# Altium schematic sheet Power.SchDoc: Power and Connectors
size A3; Organization: Hash define Electronics Ltd; Address1: 68 Concord Street; Address2: Leeds, WY; Address3: LS2 7QS; Address4: United Kindom; Revision: 0; SheetNumber: 2; SheetTotal: 2
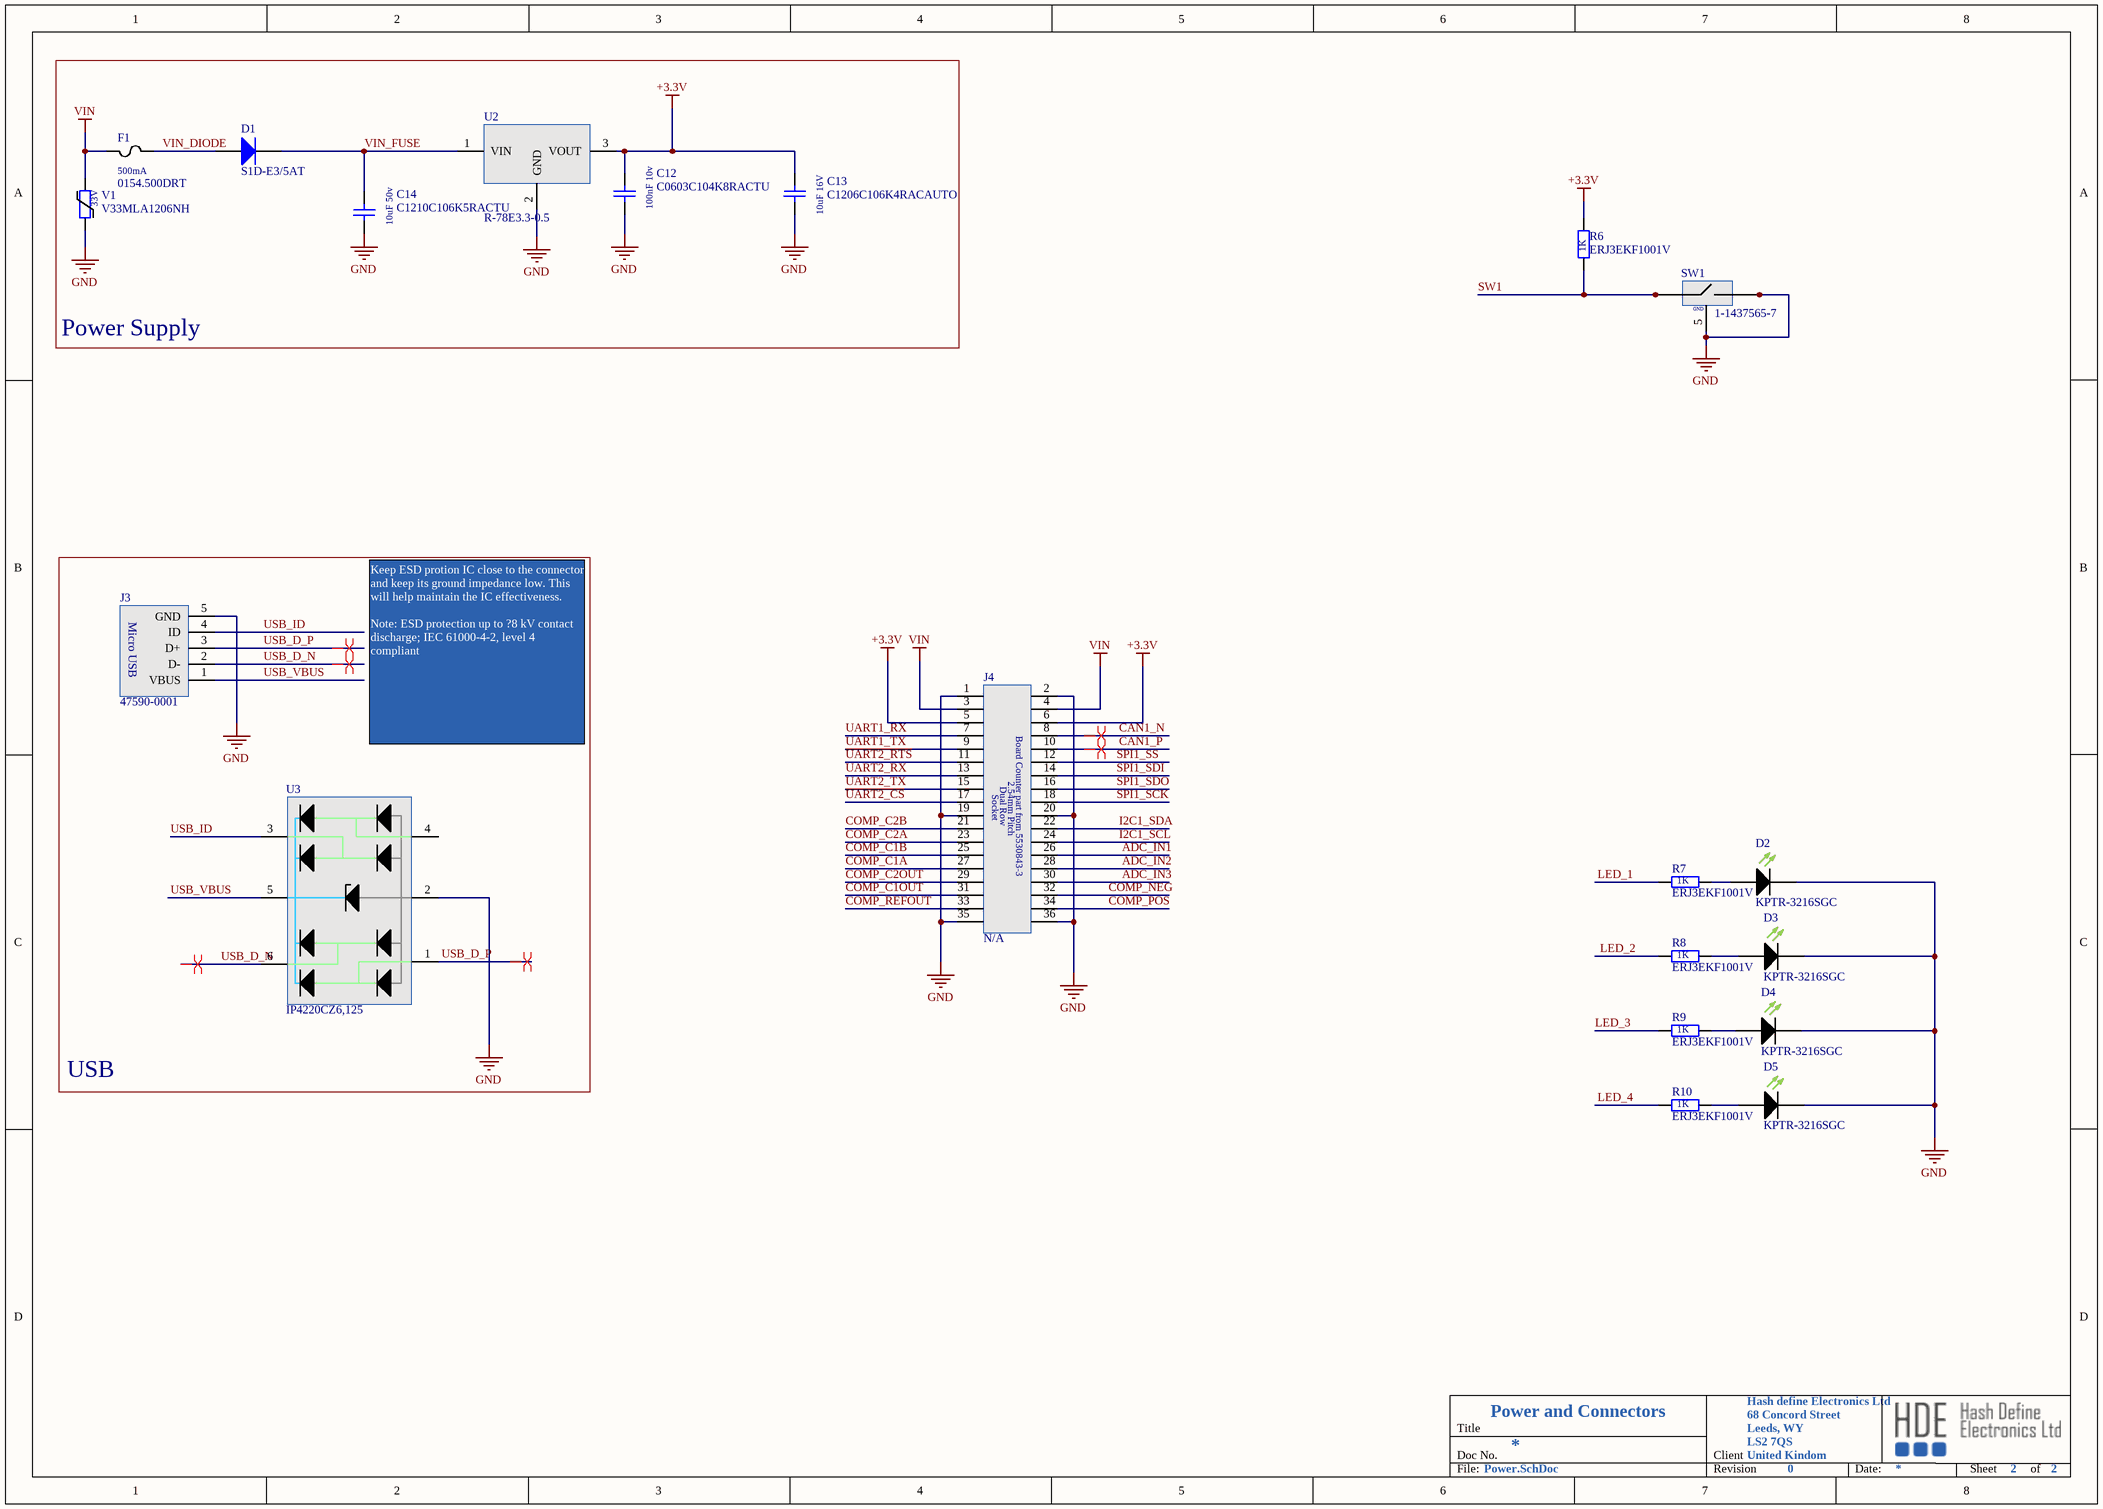
[diagram p0: Power.SchDoc]

## Parts
C12  #NAME?  [CAP_0603]  (value not drawn)
C13  #NAME?  [CAP_1206]  (value not drawn)
C14  #NAME?  [CAP_1210]  (value not drawn)
D1  #NAME?  [DO-214AC]  (value not drawn)
D2  LED  [LED_1206]  (value not drawn)
D3  LED  [LED_1206]  (value not drawn)
D4  LED  [LED_1206]  (value not drawn)
D5  LED  [LED_1206]  (value not drawn)
F1  #NAME?  [SMF_OMNI-BLOK]  (value not drawn)
J3  47590-0001  [47590-0001]
J4  N/A  [5530843-3_BoardEdge]
R6  #NAME?  [RES_0603]  (value not drawn)
R7  #NAME?  [RES_0603]  (value not drawn)
R8  #NAME?  [RES_0603]  (value not drawn)
R9  #NAME?  [RES_0603]  (value not drawn)
R10  #NAME?  [RES_0603]  (value not drawn)
SW1  1-1437565-7  [1-1437565-7]
U2  #NAME?  [R-78E3.3-0.5]  (value not drawn)
U3  IP4220CZ6,125  [TSOP6]
V1  #NAME?  [1206_LittelFuse_Varistor]  (value not drawn)

## Blocks framed on the sheet
Power Supply: C12-C14 D1 F1 U2 V1
USB: J3 U3

## Nets
+3.3V: C12.2 C13.2 J4.5 J4.6 R6.2 U2.3(VOUT)
GND: C12.1 C13.1 C14.1 D2.1(K) D3.1(K) D4.1(K) D5.1(K) J3.5(GND) J4.1 J4.2 J4.19 J4.20 J4.35 J4.36 SW1.3 SW1.4 SW1.5(GND) U2.2(GND) U3.2(GND) V1.1
VIN: F1.1 J4.3 J4.4 V1.2
ADC_IN1: J4.26
ADC_IN2: J4.28
ADC_IN3: J4.30
CAN1_N: J4.8
CAN1_P: J4.10
COMP_C1A: J4.27
COMP_C1B: J4.25
COMP_C1OUT: J4.31
COMP_C2A: J4.23
COMP_C2B: J4.21
COMP_C2OUT: J4.29
COMP_NEG: J4.32
COMP_POS: J4.34
COMP_REFOUT: J4.33
I2C1_SCL: J4.24
I2C1_SDA: J4.22
LED_1: R7.1
LED_2: R8.1
LED_3: R9.1
LED_4: R10.1
SPI1_SCK: J4.18
SPI1_SDI: J4.14
SPI1_SDO: J4.16
SPI1_SS: J4.12
SW1: R6.1 SW1.1 SW1.2
~{UART2_CS}: J4.17
~{UART2_RTS}: J4.11
UART1_RX: J4.7
UART1_TX: J4.9
UART2_RX: J4.13
UART2_TX: J4.15
USB_D_N: J3.2(D-) U3.6(IO4)
USB_D_P: J3.3(D+) U3.1(IO1)
USB_ID: J3.4(ID) U3.3(IO2)
USB_VBUS: J3.1(VBUS) U3.5(Vp)
VIN_DIODE: D1.2(A) F1.2
VIN_FUSE: C14.2 D1.1(K) U2.1(VIN)
NetD2_2: D2.2(A) R7.2
NetD3_2: D3.2(A) R8.2
NetD4_2: D4.2(A) R9.2
NetD5_2: D5.2(A) R10.2

Not connected (* = marked no-connect by the designer): U3 4(IO3)

## Layout directives
differential pair: CAN1_N, CAN1_P, USB_D_N, USB_D_P

## Notes on the sheet
- VIN Range: 7.1V - 28V
- Keep ESD protion IC close to the connector and keep its ground impedance low. This will help maintain the IC effectiveness.
  Note: ESD protection up to ?8 kV contact discharge; IEC 61000-4-2, level 4 compliant
- Title
- Doc No.
- Client
- File:
- Revision
- Date:
- Sheet
- of
- (in symbol 0154.500DRT) 500mA
- (in symbol 47590-0001) Micro USB
- (in symbol 5530843-3_BoardEdge) Board Counter part from 5530843-3; 2.54mm Pitch; Dual Row; Socket
- (in symbol C0603C104K8RACTU) 100nF 10v
- (in symbol C1206C106K4RACAUTO) 10uF 16V
- (in symbol C1210C106K5RACTU) 10uF 50v
- (in symbol ERJ3EKF1001V) 1K
- (in symbol V33MLA1206NH) 33V

## Library data of the parts
C12 = C0603C104K8RACTU: 100nF, 10V, 0603, -55C to 125C, X7R, 10%; Manufacture: KEMET; Type: Capacitor; Surface_Mount: true; Farnell Code: 2112833; PartNum: C0603C104K8RACTU
C13 = C1206C106K4RACAUTO: 10uF, 16V,  1206, -55C to 125C, X7R, 10%, Automotive; Manufacture: KEMET; Type: Capacitor; Surface_Mount: true; Farnell Code: 2070502; PartNum: C1206C106K4RACAUTO
C14 = C1210C106K5RACTU: MLCC, X7R, 10uF, 50V, 1210; Manufacture: KEMET; Type: Capacitor; Surface_Mount: true; Farnell Code: 2449143; PartNum: C1210C106K5RACTU
D1 = S1D-E3/5AT: 1A, 200V, SMD Diode; Manufacture: VISHAY SEMICONDUCTOR; Type: Varistor; Surface_Mount: true; Farnell Code: 9550232; PartNum: S1D-E3/5AT
D2-D5 = KPTR-3216SGC: Green, 1206, SMD LED; Manufacture: KINGBRIGHT; Surface_Mount: true; Farnell Code: 2099255; Type: LED; PartNum: KPTR-3216SGC
F1 = 0154.500DRT: 500mA, SMD, 125v, -55C to 125C; Manufacture: LITTELFUSE; Type: Fuse; Surface_Mount: true; Farnell Code: 9943684; PartNum: 0154.500DRT
J3 = 47590-0001: Micro USB, Top Mount; Manufacture: Molex; Surface_Mount: true; Type: Connector; Farnell Code: 1568022; PartNum: 47590-0001
J4 = 5530843-3_BoardEdge: 36way dual row 2.54mm socket. Board edge counter partconnector; Surface_Mount: true; Farnell Code: N/A; Manufacture: N/A; Type: Connector; PartNum: N/A
R6-R10 = ERJ3EKF1001V: 1K, 0603, 1%, 0.1W, resistor; Manufacture: PANASONIC ELECTRONIC COMPONENTS; Surface_Mount: true; Farnell Code: 2303145; Type: Resistor; PartNum: ERJ3EKF1001V
SW1 = 1-1437565-7: TACTILE SWITCH, SPST, 0.05A, 24V; Manufacture: TE CONNECTIVITY / ALCOSWITCH; Surface_Mount: true; Farnell Code: 2468759; Type: Connector; PartNum: 1-1437565-7
U2 = R-78E3.3-0.5: 3.3V, 500mA, DC-DC; Manufacture: RECOM POWER; Surface_Mount: false; Type: Regulator; Farnell Code: 2218602; PartNum: R-78E3.3-0.5
U3 = IP4220CZ6,125: ESD PROTECTION, DUAL USB 2.0, 6TSOP; Manufacture: NXP; Surface_Mount: true; Farnell Code: 1506629; Type: ESD Protection; PartNum: IP4220CZ6,125
V1 = V33MLA1206NH: 33V, 1206, 180Apk, Clamp 75V; Manufacture: LITTELFUSE; Surface_Mount: true; Farnell Code: 1816942; Type: Varistor; PartNum: V33MLA1206NH